# Altium schematic sheet 04) UART to USB debug p.SchDoc
size 386 x 246 mm
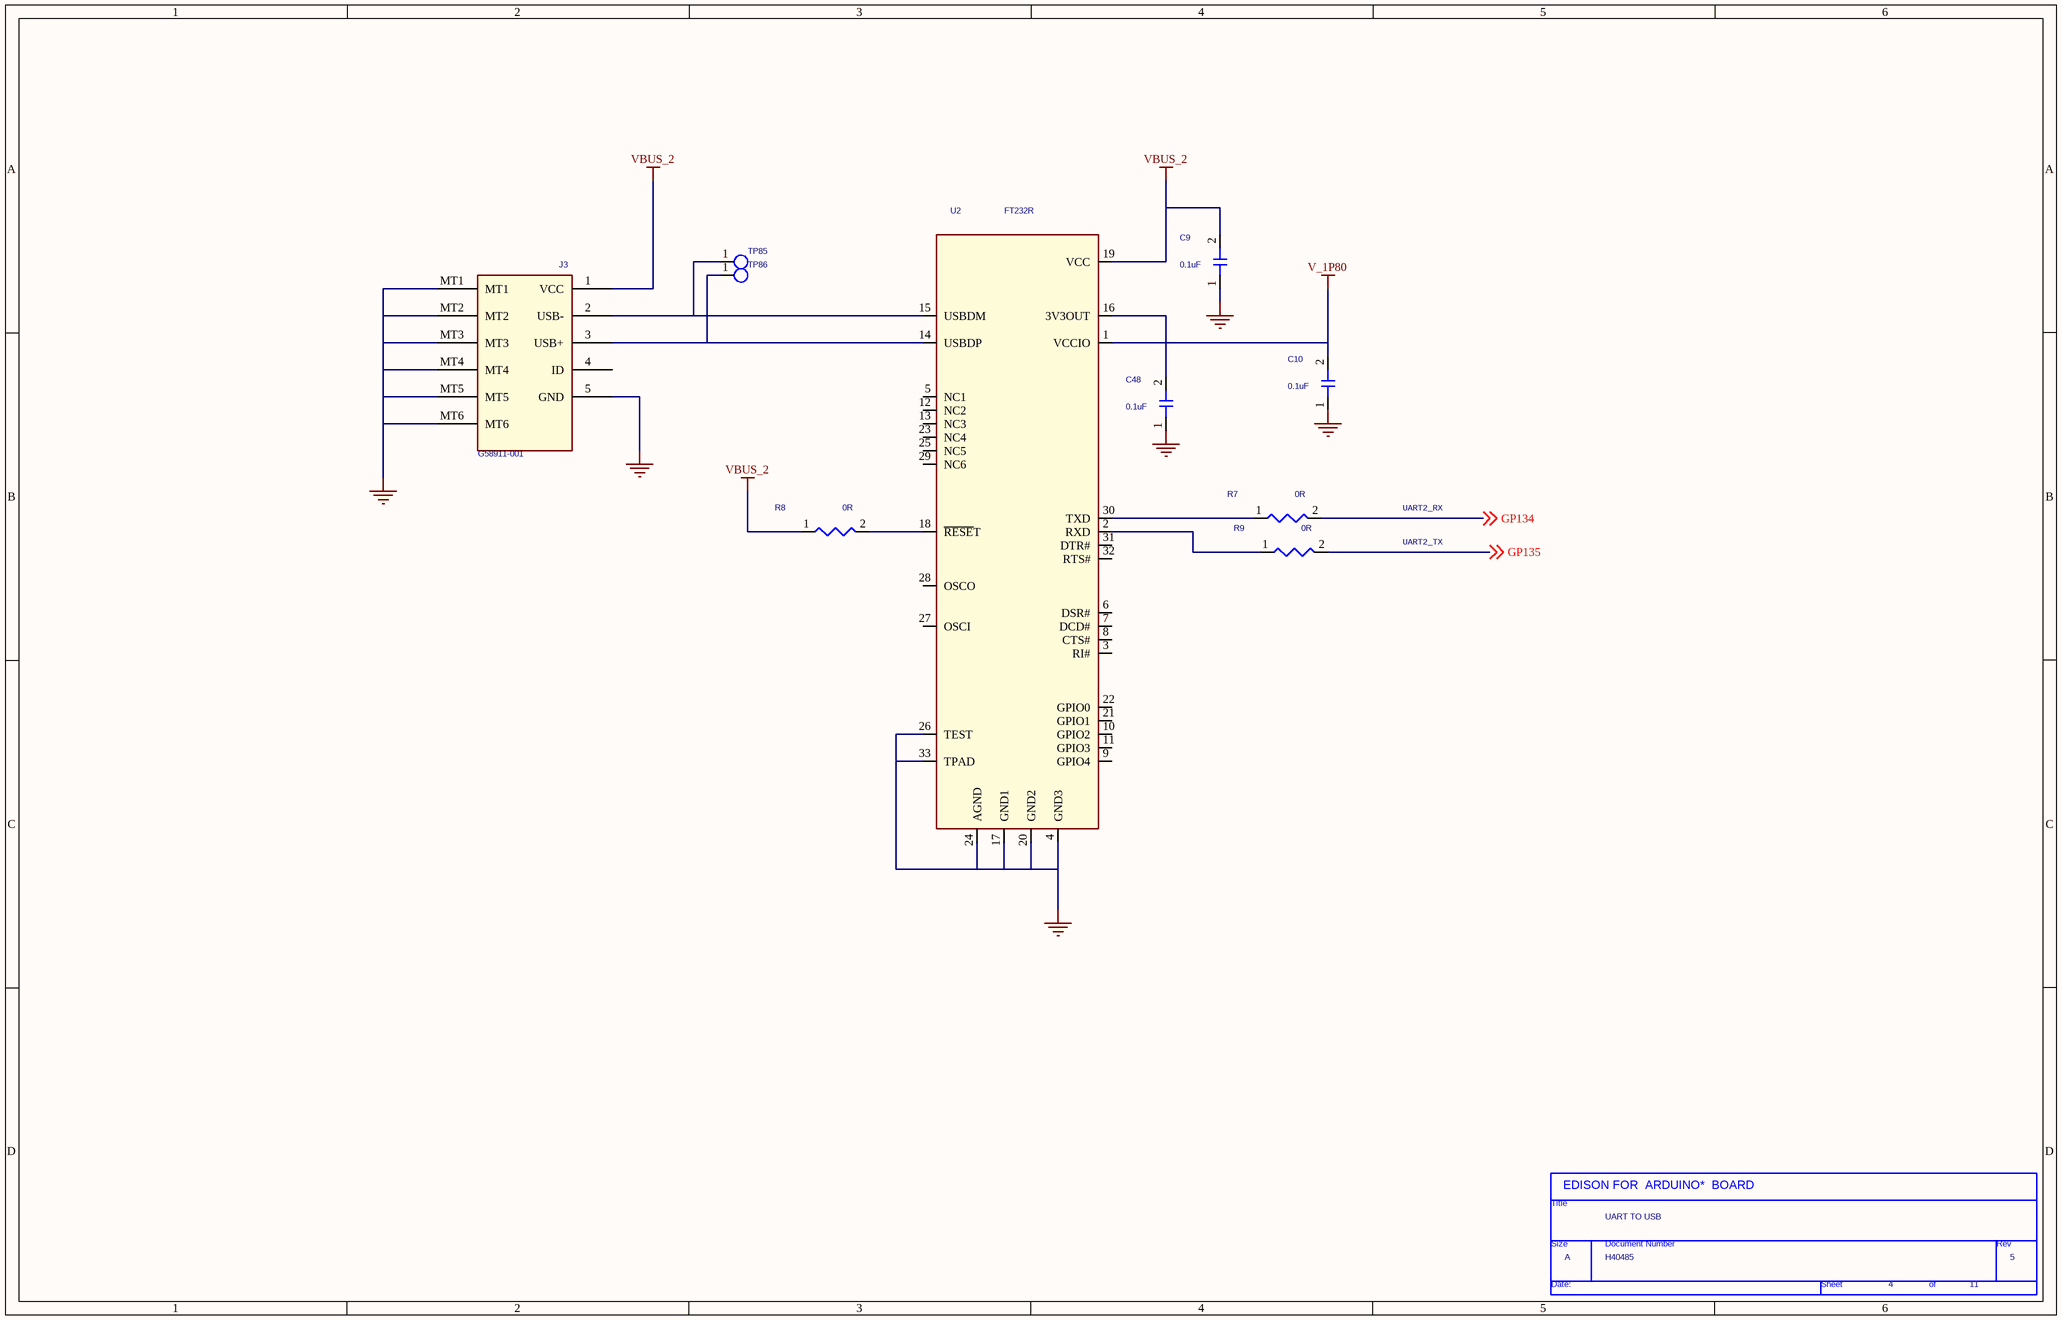
[diagram p0: 04) UART to USB debug p.SchDoc]

## Parts
*  Page Count: 11  Page Number: 4  Page Size: A  Title: UART TO USB  RevCode: 5  Doc: H40485  (hidden comment: TitleBlock0)  (graphical)
C9  0.1uF  [C0201]
C10  0.1uF  [C0201]
C48  0.1uF  [C0201]
J3  G58911-001  [RCPT_USB_5P_DIP_SM]
R7  0R  [0603.PRT]
R8  0R  [0603.PRT]
R9  0R  [0603.PRT]
TP85  30 MIL TESTPAD  [TESTPAD_C80]  (value not drawn)
TP86  30 MIL TESTPAD  [TESTPAD_C80]  (value not drawn)
U2  FT232R  [lcc32_p5mm_3p2sq_nonc]

## Nets
GND: C9.1(END1) C10.1(END1) C48.1(END1) J3.5(GND) J3.MT1 J3.MT2 J3.MT3 J3.MT4 J3.MT5 J3.MT6 U2.4(GND3) U2.17(GND1) U2.20(GND2) U2.24(AGND) U2.26(TEST) U2.33(TPAD)
V_1P80: C10.2(END2) U2.1(VCCIO)
VBUS_2: C9.2(END2) J3.1(VCC) R8.1 U2.19(VCC)
GP134: R7.2 ; off-sheet GP134
GP135: R9.2 ; off-sheet GP135
NetC48_2: C48.2(END2) U2.16(3V3OUT)
NetJ3_2: J3.2(USB-) TP85.1 U2.15(USBDM)
NetJ3_3: J3.3(USB+) TP86.1 U2.14(USBDP)
NetR7_1: R7.1 U2.30(TXD)
NetR8_2: R8.2 U2.18(~{RESE}T)
NetR9_1: R9.1 U2.2(RXD)

Not connected (* = marked no-connect by the designer): J3 4(ID); U2 3(RI#) 5(NC1) 6(DSR#) 7(DCD#) 8(CTS#) 9(GPIO4) 10(GPIO2) 11(GPIO3) 12(NC2) 13(NC3) 21(GPIO1) 22(GPIO0) 23(NC4) 25(NC5) 27(OSCI) 28(OSCO) 29(NC6) 31(DTR#) 32(RTS#)

## Notes on the sheet
- UART2_RX
- UART2_TX
- (in symbol TitleBlock0) EDISON FOR  ARDUINO*  BOARD; Title; Size; Document Number; Rev; Date:; Sheet; of

## Library data of the parts
C9 C10 C48 = CAP: CAPC,X5R,0201,0.1UF,10.00V,+/- 10%; PART_NUMBER: C83410-014; Manufacturer: GENERIC; OriginalSymbolOrigin: (-50,50); Process: SMD; Code: 27; VOLTAGE: ?; PERC: ?; PATH: ?
J3 = CON4,USB,RA,_1: CONN,MISC,5P,MICRO USB,B TYPE,RECEPT,2013499-1; BOM: x; LEAD_FREE: YES; NO_STUFF: .; FINANCE: x; IPN: G58911-001; DEVICE: G58911-001; PART_NUMBER: G58911-001
R7 R8 = R_0: RES_D,0201,0.00OHM,1/20W; Manufacturer: Yageo; PART_NUMBER: C80792-009
R9 = R_0: RES_D,0201,0.00OHM,1/20W; PART_NUMBER: C80792-009; Manufacturer: Yageo
TP85 TP86 = TestPad,C80,SMT: LEAD_FREE: NO; FINANCE: x; IPN: TESTPAD_80; DEVICE: TESTPAD_30; ROOM: TEST_APE; BOM: x; PART_NUMBER: TESTPAD_30; NO_STUFF: NO_STUFF
U2 = FT232R_0: IC,VLSI,OTHER,FT232,QFN,32; PART_NUMBER: H40970-001; MFG PN: FT232RQ-REEL
* = TitleBlock0: Page Create Date: March  8, 1995